# Altium schematic sheet power.SchDoc
size A
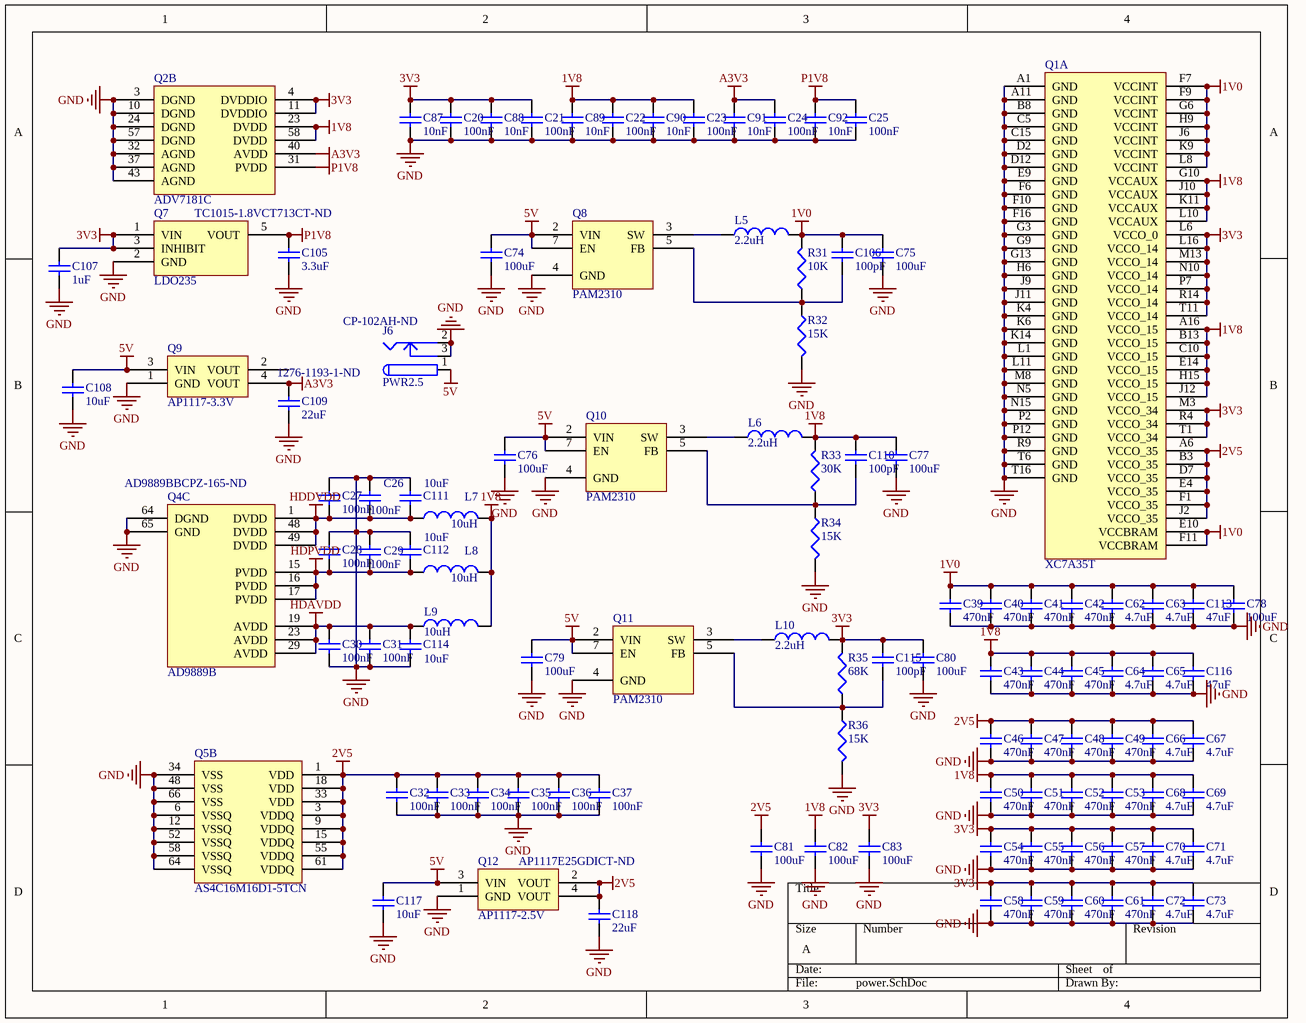
[diagram p0: power.SchDoc]

## Parts
C20  value 100nF  [CAPC1005X06L]  (hidden comment: Cap)
C21  value 100nF  [CAPC1005X06L]  (hidden comment: Cap)
C22  value 100nF  [CAPC1005X06L]  (hidden comment: Cap)
C23  value 100nF  [CAPC1005X06L]  (hidden comment: Cap)
C24  value 100nF  [CAPC1005X06L]  (hidden comment: Cap)
C25  value 100nF  [CAPC1005X06L]  (hidden comment: Cap)
C26  value 100nF  [CAPC1005X06L]  (hidden comment: Cap)
C27  value 100nF  [CAPC1005X06L]  (hidden comment: Cap)
C28  value 100nF  [CAPC1005X06L]  (hidden comment: Cap)
C29  value 100nF  [CAPC1005X06L]  (hidden comment: Cap)
C30  value 100nF  [CAPC1005X06L]  (hidden comment: Cap)
C31  value 100nF  [CAPC1005X06L]  (hidden comment: Cap)
C32  value 100nF  [CAPC1005X06L]  (hidden comment: Cap)
C33  value 100nF  [CAPC1005X06L]  (hidden comment: Cap)
C34  value 100nF  [CAPC1005X06L]  (hidden comment: Cap)
C35  value 100nF  [CAPC1005X06L]  (hidden comment: Cap)
C36  value 100nF  [CAPC1005X06L]  (hidden comment: Cap)
C37  value 100nF  [CAPC1005X06L]  (hidden comment: Cap)
C39  value 470nF  [CAPC1005X06L]  (hidden comment: Cap)
C40  value 470nF  [CAPC1005X06L]  (hidden comment: Cap)
C41  value 470nF  [CAPC1005X06L]  (hidden comment: Cap)
C42  value 470nF  [CAPC1005X06L]  (hidden comment: Cap)
C43  value 470nF  [CAPC1005X06L]  (hidden comment: Cap)
C44  value 470nF  [CAPC1005X06L]  (hidden comment: Cap)
C45  value 470nF  [CAPC1005X06L]  (hidden comment: Cap)
C46  value 470nF  [CAPC1005X06L]  (hidden comment: Cap)
C47  value 470nF  [CAPC1005X06L]  (hidden comment: Cap)
C48  value 470nF  [CAPC1005X06L]  (hidden comment: Cap)
C49  value 470nF  [CAPC1005X06L]  (hidden comment: Cap)
C50  value 470nF  [CAPC1005X06L]  (hidden comment: Cap)
C51  value 470nF  [CAPC1005X06L]  (hidden comment: Cap)
C52  value 470nF  [CAPC1005X06L]  (hidden comment: Cap)
C53  value 470nF  [CAPC1005X06L]  (hidden comment: Cap)
C54  value 470nF  [CAPC1005X06L]  (hidden comment: Cap)
C55  value 470nF  [CAPC1005X06L]  (hidden comment: Cap)
C56  value 470nF  [CAPC1005X06L]  (hidden comment: Cap)
C57  value 470nF  [CAPC1005X06L]  (hidden comment: Cap)
C58  value 470nF  [CAPC1005X06L]  (hidden comment: Cap)
C59  value 470nF  [CAPC1005X06L]  (hidden comment: Cap)
C60  value 470nF  [CAPC1005X06L]  (hidden comment: Cap)
C61  value 470nF  [CAPC1005X06L]  (hidden comment: Cap)
C62  value 4.7uF  [CAPC1608X90N]  (hidden comment: Cap)
C63  value 4.7uF  [CAPC1608X90N]  (hidden comment: Cap)
C64  value 4.7uF  [CAPC1608X90N]  (hidden comment: Cap)
C65  value 4.7uF  [CAPC1608X90N]  (hidden comment: Cap)
C66  value 4.7uF  [CAPC1608X90N]  (hidden comment: Cap)
C67  value 4.7uF  [CAPC1608X90N]  (hidden comment: Cap)
C68  value 4.7uF  [CAPC1608X90N]  (hidden comment: Cap)
C69  value 4.7uF  [CAPC1608X90N]  (hidden comment: Cap)
C70  value 4.7uF  [CAPC1608X90N]  (hidden comment: Cap)
C71  value 4.7uF  [CAPC1608X90N]  (hidden comment: Cap)
C72  value 4.7uF  [CAPC1608X90N]  (hidden comment: Cap)
C73  value 4.7uF  [CAPC1608X90N]  (hidden comment: Cap)
C74  value 100uF  [CAPC3216X100N]  (hidden comment: Cap)
C75  value 100uF  [CAPC3216X100N]  (hidden comment: Cap)
C76  value 100uF  [CAPC3216X100N]  (hidden comment: Cap)
C77  value 100uF  [CAPC3216X100N]  (hidden comment: Cap)
C78  value 100uF  [CAPC3216X100N]  (hidden comment: Cap)
C79  value 100uF  [CAPC3216X100N]  (hidden comment: Cap)
C80  value 100uF  [CAPC3216X100N]  (hidden comment: Cap)
C81  value 100uF  [CAPC3216X100N]  (hidden comment: Cap)
C82  value 100uF  [CAPC3216X100N]  (hidden comment: Cap)
C83  value 100uF  [CAPC3216X100N]  (hidden comment: Cap)
C87  value 10nF  [CAPC1005X06L]  (hidden comment: Cap)
C88  value 10nF  [CAPC1005X06L]  (hidden comment: Cap)
C89  value 10nF  [CAPC1005X06L]  (hidden comment: Cap)
C90  value 10nF  [CAPC1005X06L]  (hidden comment: Cap)
C91  value 10nF  [CAPC1005X06L]  (hidden comment: Cap)
C92  value 10nF  [CAPC1005X06L]  (hidden comment: Cap)
C105  value 3.3uF  [CAPC1608X90N]  (hidden comment: Cap)
C106  value 100pF  [CAPC1608X90N]  (hidden comment: Cap)
C107  value 1uF  [CAPC1608X90N]  (hidden comment: Cap)
C108  value 10uF  [CAPC1608X90N]  (hidden comment: Cap)
C109  value 22uF  Supplier Part Number 1: 1276-1193-1-ND  [CAPC1608X90N]  (hidden comment: Cap)
C110  value 100pF  [CAPC1608X90N]  (hidden comment: Cap)
C111  value 10uF  [CAPC1608X90N]  (hidden comment: Cap)
C112  value 10uF  [CAPC1608X90N]  (hidden comment: Cap)
C113  value 47uF  [CAPC2012X135N]  (hidden comment: Cap)
C114  value 10uF  [CAPC1608X90N]  (hidden comment: Cap)
C115  value 100pF  [CAPC1608X90N]  (hidden comment: Cap)
C116  value 47uF  [CAPC2012X135N]  (hidden comment: Cap)
C117  value 10uF  [CAPC1608X90N]  (hidden comment: Cap)
C118  value 22uF  [CAPC1608X90N]  (hidden comment: Cap)
J6  PWR2.5  Supplier Part Number 1: CP-102AH-ND  [PJ-102A]
L5  value 2.2uH  [NRS8030T2R2NJGJ]  (hidden comment: NRS8030T2R2NJGJ)
L6  value 2.2uH  [NRS8030T2R2NJGJ]  (hidden comment: NRS8030T2R2NJGJ)
L7  value 10uH  [CAPC3225X220N]  (hidden comment: LBC3225T100KR)
L8  value 10uH  [CAPC3225X220N]  (hidden comment: LBC3225T100KR)
L9  value 10uH  [CAPC3225X220N]  (hidden comment: LBC3225T100KR)
L10  value 2.2uH  [NRS8030T2R2NJGJ]  (hidden comment: NRS8030T2R2NJGJ)
Q1  XC7A35T  (part A of 6)
Q2  ADV7181C  [TSQFP50P1200X1200X145-64N]  (part B of 3)
Q4  AD9889B  Supplier Part Number 1: AD9889BBCPZ-165-ND  [QFN50P900X875X100_HS-65N]  (part C of 3)
Q5  AS4C16M16D1-5TCN  [TSOP65P1180X120-66N]  (part B of 2)
Q7  LDO235  Supplier Part Number 1: TC1015-1.8VCT713CT-ND  [SOT23-5]
Q8  PAM2310  [SOIC127P600X175-8AN]
Q9  AP1117-3.3V  [SOT223]
Q10  PAM2310  [SOIC127P600X175-8AN]
Q11  PAM2310  [SOIC127P600X175-8AN]
Q12  AP1117-2.5V  Supplier Part Number 1: AP1117E25GDICT-ND  [SOT223]
R31  value 10K  [CAPC1608X90N]  (hidden comment: Res3)
R32  value 15K  [CAPC1608X90N]  (hidden comment: Res3)
R33  value 30K  [CAPC1608X90N]  (hidden comment: Res3)
R34  value 15K  [CAPC1608X90N]  (hidden comment: Res3)
R35  value 68K  [CAPC1608X90N]  (hidden comment: Res3)
R36  value 15K  [CAPC1608X90N]  (hidden comment: Res3)

## Nets
1V0: C39.2 C40.2 C41.2 C42.2 C62.1 C63.1 C75.1 C78.1 C106.1 C113.1 L5.2 Q1.E10(VCCBRAM) Q1.F7(VCCINT) Q1.F9(VCCINT) Q1.F11(VCCBRAM) Q1.G6(VCCINT) Q1.H9(VCCINT) Q1.J6(VCCINT) Q1.K9(VCCINT) Q1.L8(VCCINT) R31.2
1V8: C22.2 C23.2 C43.2 C44.2 C45.2 C50.2 C51.2 C52.2 C53.2 C64.1 C65.1 C68.1 C69.1 C77.1 C82.1 C89.2 C90.2 C110.1 C116.1 L6.2 L7.2 L8.2 L9.2 Q1.A16(VCCO_15) Q1.B13(VCCO_15) Q1.C10(VCCO_15) Q1.E14(VCCO_15) Q1.G10(VCCAUX) Q1.H15(VCCO_15) Q1.J10(VCCAUX) Q1.J12(VCCO_15) Q1.K11(VCCAUX) Q1.L10(VCCAUX) Q2.23(DVDD) Q2.58(DVDD) R33.2
2V5: C32.2 C33.2 C34.2 C35.2 C36.2 C37.2 C46.2 C47.2 C48.2 C49.2 C66.1 C67.1 C81.1 C118.1 Q1.A6(VCCO_35) Q1.B3(VCCO_35) Q1.D7(VCCO_35) Q1.E4(VCCO_35) Q1.F1(VCCO_35) Q1.J2(VCCO_35) Q5.1(VDD) Q5.3(VDDQ) Q5.9(VDDQ) Q5.15(VDDQ) Q5.18(VDD) Q5.33(VDD) Q5.55(VDDQ) Q5.61(VDDQ) Q12.2(VOUT) Q12.4(VOUT)
3V3: C20.2 C21.2 C54.2 C55.2 C56.2 C57.2 C58.2 C59.2 C60.2 C61.2 C70.1 C71.1 C72.1 C73.1 C80.1 C83.1 C87.2 C88.2 C107.1 C115.1 L10.2 Q1.L6(VCCO_0) Q1.L16(VCCO_14) Q1.M3(VCCO_34) Q1.M13(VCCO_14) Q1.N10(VCCO_14) Q1.P7(VCCO_14) Q1.R4(VCCO_34) Q1.R14(VCCO_14) Q1.T1(VCCO_34) Q1.T11(VCCO_14) Q2.4(DVDDIO) Q2.11(DVDDIO) Q7.1(VIN) Q7.3(INHIBIT) R35.2
5V: C74.1 C76.1 C79.1 C108.1 C117.1 J6.1 Q8.2(VIN) Q8.7(EN) Q9.3(VIN) Q10.2(VIN) Q10.7(EN) Q11.2(VIN) Q11.7(EN) Q12.3(VIN)
A3V3: C24.2 C91.2 C109.1 Q2.40(AVDD) Q9.4(VOUT)
GND: C20.1 C21.1 C22.1 C23.1 C24.1 C25.1 C26.2 C27.2 C28.2 C29.2 C30.1 C31.1 C32.1 C33.1 C34.1 C35.1 C36.1 C37.1 C39.1 C40.1 C41.1 C42.1 C43.1 C44.1 C45.1 C46.1 C47.1 C48.1 C49.1 C50.1 C51.1 C52.1 C53.1 C54.1 C55.1 C56.1 C57.1 C58.1 C59.1 C60.1 C61.1 C62.2 C63.2 C64.2 C65.2 C66.2 C67.2 C68.2 C69.2 C70.2 C71.2 C72.2 C73.2 C74.2 C75.2 C76.2 C77.2 C78.2 C79.2 C80.2 C81.2 C82.2 C83.2 C87.1 C88.1 C89.1 C90.1 C91.1 C92.1 C105.2 C107.2 C108.2 C109.2 C111.1 C112.1 C113.2 C114.2 C116.2 C117.2 C118.2 J6.2 J6.3 Q1.A1(GND) Q1.A11(GND) Q1.B8(GND) Q1.C5(GND) Q1.C15(GND) Q1.D2(GND) Q1.D12(GND) Q1.E9(GND) Q1.F6(GND) Q1.F10(GND) Q1.F16(GND) Q1.G3(GND) Q1.G9(GND) Q1.G13(GND) Q1.H6(GND) Q1.J9(GND) Q1.J11(GND) Q1.K4(GND) Q1.K6(GND) Q1.K14(GND) Q1.L1(GND) Q1.L11(GND) Q1.M8(GND) Q1.N5(GND) Q1.N15(GND) Q1.P2(GND) Q1.P12(GND) Q1.R9(GND) Q1.T6(GND) Q1.T16(GND) Q2.3(DGND) Q2.10(DGND) Q2.24(DGND) Q2.32(AGND) Q2.37(AGND) Q2.43(AGND) Q2.57(DGND) Q4.64(DGND) Q4.65(GND) Q5.6(VSSQ) Q5.12(VSSQ) Q5.34(VSS) Q5.48(VSS) Q5.52(VSSQ) Q5.58(VSSQ) Q5.64(VSSQ) Q5.66(VSS) Q7.2(GND) Q8.4(GND) Q9.1(GND) Q10.4(GND) Q11.4(GND) Q12.1(GND) R32.2 R34.2 R36.2
HDAVDD: C30.2 C31.2 C114.1 L9.1 Q4.19(AVDD) Q4.23(AVDD) Q4.29(AVDD)
HDDVDD: C26.1 C27.1 C111.2 L7.1 Q4.1(DVDD) Q4.48(DVDD) Q4.49(DVDD)
HDPVDD: C28.1 C29.1 C112.2 L8.1 Q4.15(PVDD) Q4.16(PVDD) Q4.17(PVDD)
P1V8: C25.2 C92.2 C105.1 Q2.31(PVDD) Q7.5(VOUT)
NetC106_2: C106.2 Q8.5(FB) R31.1 R32.1
NetC110_2: C110.2 Q10.5(FB) R33.1 R34.1
NetC115_2: C115.2 Q11.5(FB) R35.1 R36.1
NetL5_1: L5.1 Q8.3(SW)
NetL6_1: L6.1 Q10.3(SW)
NetL10_1: L10.1 Q11.3(SW)

Not connected (* = marked no-connect by the designer): Q9 2(VOUT)

## Library data of the parts
C20-C37 C39-C83 C87-C92 C105-C118 = Cap: Capacitor; Published: 8-Jun-2000; LatestRevisionDate: 17-Jul-2002; LatestRevisionNote: Re-released for DXP Platform.; PackageReference: RAD-0.3; Publisher: Altium Limited; PackageDescription: Radial Cap, Thru-Hole; 2 Leads; 0.3 in Pin Spacing
  C39-C61: Supplier 1: Digi-Key; Supplier Part Number 1: 490-3266-1-ND
  C62-C73: Supplier 1: Digi-Key; Supplier Part Number 1: 490-3297-1-ND
  C74 C76 C79: Supplier 1: Digi-Key; Supplier Part Number 1: 490-4512-1-ND
  C75 C77 C78 C80-C83: Supplier 1: Digi-Key; Supplier Part Number 1: 490-9966-1-ND
  C87-C92: Supplier 1: Digi-Key; Supplier Part Number 1: 1276-1057-1-ND
  C105: Supplier 1: Digi-Key; Supplier Part Number 1: 1276-1893-1-ND
  C106 C110 C115: Supplier 1: Digi-Key; Supplier Part Number 1: 1276-1909-1-ND
  C107: Supplier 1: Digi-Key; Supplier Part Number 1: 1276-1024-1-ND
  C108 C111 C112 C114 C117: Supplier 1: Digi-Key; Supplier Part Number 1: 1276-1119-1-ND
  C109: Supplier 1: Digi-Key
  C113 C116: Supplier 1: Digi-Key; Supplier Part Number 1: 490-6469-1-ND
  C118: Supplier 1: Digi-Key; Supplier Part Number 1: 1276-1193-1-ND
J6 = PWR2.5: Low Voltage Power Supply Connector; Published: 17-Dec-2003; DatasheetDocument: 09-May-2002; Publisher: Altium Limited; ComponentLink1Description: Manufacturer Link; ComponentLink1URL: http://domino.kycon.com/internet/Products.html; Supplier 1: Digi-Key
L5-L10 = Inductor: Code_IEC: 1005; Published: 8-Jun-2000; LatestRevisionDate: 29-May-2009; LatestRevisionNote: IPC-7351 Footprint Added.; PackageReference: 0402-A; Publisher: Altium Limited; PackageDescription: Chip Inductor; Code_JEITA: 0402; Supplier 1: Digi-Key
  L5 L6 L10: Supplier Part Number 1: 587-2965-1-ND
  L7-L9: Supplier Part Number 1: 587-2421-1-ND
Q5 = DDR256: Supplier 1: Digi-Key; Supplier Part Number 1: 1450-1000-ND
Q9 Q12 = AP1117: Supplier 1: Digi-Key
  Q9: Supplier Part Number 1: AP1117E33GDICT-ND
R31-R36 = Res3: Resistor; Published: 8-Jun-2000; LatestRevisionDate: 29-May-2009; LatestRevisionNote: IPC-7351 Footprint Added.; PackageReference: J1-0603; Publisher: Altium Limited; PackageDescription: Chip Resistor; Supplier 1: Digi-Key
  R31: Supplier Part Number 1: 1276-3485-1-ND
  R32 R34 R36: Supplier Part Number 1: 1276-4758-1-ND
  R33: Supplier Part Number 1: 1276-4786-1-ND
  R35: Supplier Part Number 1: 1276-4823-1-ND
Q4 = AD9889B: Supplier 1: Digi-Key
Q7 = LDO235: Supplier 1: Digi-Key
Q8 Q10 Q11 = PAM2310: Supplier 1: Digi-Key; Supplier Part Number 1: PAM2310BECADJRDICT-ND